# Altium project smarchSettlers_MCU.PrjPcb
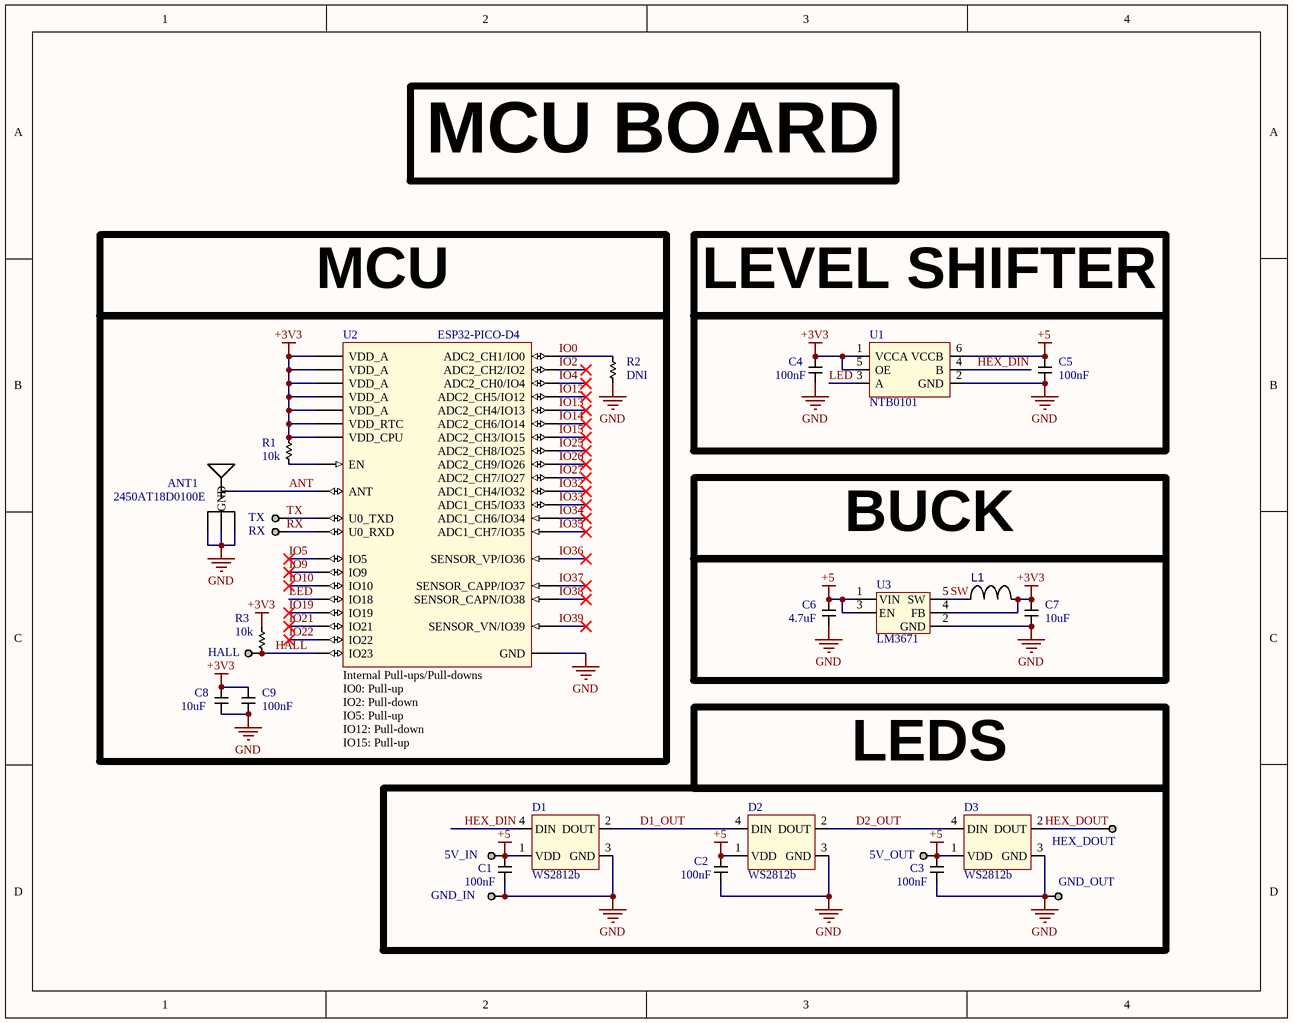
[diagram p0: Main.SchDoc]
1 sheet, 28 parts. Net scope: global (net labels, ports and power ports of the same name join across sheets).

## Sheet Main.SchDoc
size A

### Parts
5V_IN  18 AWG Hole  [18 AWG Hole]  (value not drawn)  (no BOM)
5V_OUT  18 AWG Hole  [18 AWG Hole]  (value not drawn)  (no BOM)
ANT1  2450AT18D0100E  [2450AT18D0100E]
C1  100nF  [CAP_0805_HIGH]
C2  100nF  [CAP_0805_HIGH]
C3  100nF  [CAP_0805_HIGH]
C4  100nF  [CAP_0402_HIGH]
C5  100nF  [CAP_0402_HIGH]
C6  4.7uF  [CAP_0603_HIGH]
C7  10uF  [CAP_0603_HIGH]
C8  10uF  [CAP_0603_HIGH]
C9  100nF  [CAP_0402_HIGH]
D1  WS2812b  [WS2812b]
D2  WS2812b  [WS2812b]
D3  WS2812b  [WS2812b]
GND_IN  18 AWG Hole  [18 AWG Hole]  (value not drawn)  (no BOM)
GND_OUT  18 AWG Hole  [18 AWG Hole]  (value not drawn)  (no BOM)
HALL  18 AWG Hole  [18 AWG Hole]  (value not drawn)  (no BOM)
HEX_DOUT  18 AWG Hole  [18 AWG Hole]  (value not drawn)  (no BOM)
L1  CIGT201610EH2R2MNE  [CIGT201610EH2R2MNE]  (value not drawn)
R1  10k  [RES_0402_HIGH]
R2  DNI  [RES_0805_HIGH]  (no BOM)
R3  10k  [RES_0402_HIGH]
RX  0.1" Header  [0.1" Header]  (value not drawn)  (no BOM)
TX  0.1" Header  [0.1" Header]  (value not drawn)  (no BOM)
U1  NTB0101  [NTB0101]
U2  ESP32-PICO-D4  [ESP32-PICO-D4]
U3  LM3671  [LM3671-BGA]

### Nets
+3V3: C4.2 C7.2 C8.2 C9.2 L1.2 R1.2 R3.2 U1.1(VCCA) U1.5(OE) U2.1(VDD_A) U2.3(VDD_A) U2.4(VDD_A) U2.19(VDD_RTC) U2.37(VDD_CPU) U2.43(VDD_A) U2.46(VDD_A) U3.4(FB)
+5: 5V_IN.1 5V_OUT.1 C1.2 C2.2 C3.2 C5.2 C6.2 D1.1(VDD) D2.1(VDD) D3.1(VDD) U1.6(VCCB) U3.1(VIN) U3.3(EN)
GND: ANT1.2(GND) ANT1.3(GND) ANT1.4(GND) C1.1 C2.1 C3.1 C4.1 C5.1 C6.1 C7.1 C8.1 C9.1 D1.3(GND) D2.3(GND) D3.3(GND) GND_IN.1 GND_OUT.1 R2.1 U1.2(GND) U2.49(GND) U3.2(GND)
ANT: ANT1.1(FEED) U2.2(ANT)
D1_OUT: D1.2(DOUT) D2.4(DIN)
D2_OUT: D2.2(DOUT) D3.4(DIN)
HALL: HALL.1 R3.1 U2.36(IO23)
HEX_DIN: D1.4(DIN) U1.4(B)
HEX_DOUT: D3.2(DOUT) HEX_DOUT.1
IO0: R2.2 U2.23(ADC2_CH1/IO0)
IO2: U2.22(ADC2_CH2/IO2)
IO4: U2.24(ADC2_CH0/IO4)
IO5: U2.34(IO5)
IO9: U2.28(IO9)
IO10: U2.29(IO10)
IO12: U2.18(ADC2_CH5/IO12)
IO13: U2.20(ADC2_CH4/IO13)
IO14: U2.17(ADC2_CH6/IO14)
IO15: U2.21(ADC2_CH3/IO15)
IO19: U2.38(IO19)
IO21: U2.42(IO21)
IO22: U2.39(IO22)
IO25: U2.14(ADC2_CH8/IO25)
IO26: U2.15(ADC2_CH9/IO26)
IO27: U2.16(ADC2_CH7/IO27)
IO32: U2.12(ADC1_CH4/IO32)
IO33: U2.13(ADC1_CH5/IO33)
IO34: U2.10(ADC1_CH6/IO34)
IO35: U2.11(ADC1_CH7/IO35)
IO36: U2.5(SENSOR_VP/IO36)
IO37: U2.6(SENSOR_CAPP/IO37)
IO38: U2.7(SENSOR_CAPN/IO38)
IO39: U2.8(SENSOR_VN/IO39)
LED: U1.3(A) U2.35(IO18)
SW: L1.1 U3.5(SW)
NetR1_1: R1.1 U2.9(EN)
NetRX_1: RX.1 U2.40(U0_RXD)
NetTX_1: TX.1 U2.41(U0_TXD)

### Notes on the sheet
- MCU BOARD
- MCU
- LEVEL SHIFTER
- BUCK
- LEDS
- Labels drawn without touching a wire or pin: RX, TX
- (in symbol ESP32-PICO-D4) Internal Pull-ups/Pull-downs / IO0: Pull-up / IO2: Pull-down / IO5: Pull-up / IO12: Pull-down / IO15: Pull-up /

### Library data of the parts
ANT1 = 2450AT18D0100E: 2450AT18D0100E 2.4GHz  Chip RF Antenna 2.4GHz ~ 2.5GHz 1.5dBi Solder Surface Mount
C1-C3 = Capacitor_0805: 0805 Capacitor
C4 C5 C9 = Capacitor_0402: 0402 Capacitor
C6-C8 = Capacitor_0603: 0603 Capacitor
D1-D3 = WS2812b: WS2812b LED RGB
L1 = CIGT201610EH2R2MNE: CIGT201610EH2R2MNE 2.2µH Unshielded Thin Film Inductor 2.5A 87mOhm Max 0806 (2016 Metric)
R1 R3 = Resistor_0402: 0402 Resistor
R2 = Resistor_0805: 0805 Resistor
U1 = NTB0101: NTB0101  Voltage Level Translator Bidirectional 1 Circuit 1 Channel 100Mbps
U2 = ESP32-PICO-D4: ESP32-PICO-D4 SoC
U3 = LM3671: LM3671 IC REG BUCK 3.3V 0.6A SYNC 5USMD